# Altium schematic sheet Optocoupler Bank.SchDoc
size A
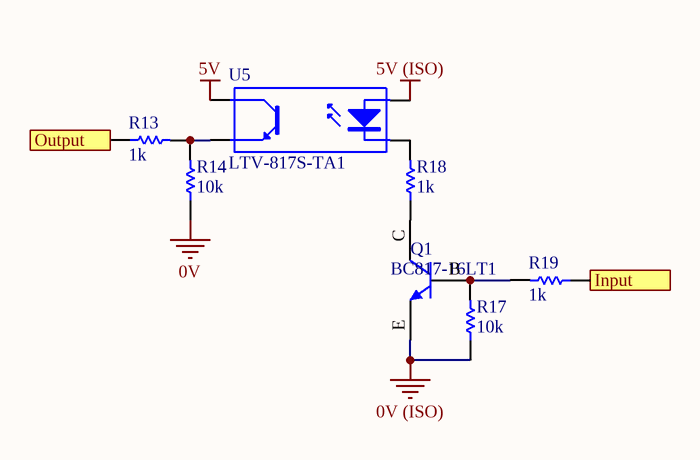
[diagram p0: Optocoupler Bank.SchDoc]

## Parts
Q1  BC817-16LT1  [ON SOT-23 BJT]
R13  1k  [0805]
R14  10k  [0805]
R17  10k  [0805]
R18  1k  [0805]
R19  1k  [0805]
U5  LTV-817S-TA1  [ON 4-SMD]

## Ports
Input (in), Output (out)

## Nets
0V: R14.1
0V (ISO): Q1.E R17.1
5V: U5.4(C)
5V (ISO): U5.1(A)
Input: R19.1 ; port Input
Output: R13.1 ; port Output
NetQ1_B: Q1.B R17.2 R19.2
NetQ1_C: Q1.C R18.1
NetR13_2: R13.2 R14.2 U5.3(E)
NetR18_2: R18.2 U5.2(K)

## Library data of the parts
Q1 = BC817-16LT1: 300mW  BJT NPN Transistor; Manufacturer: ON Semiconductor; Part Number: BC817-16LT1; Digikey Part Number: BC817-16LT1OSTR-ND; Digikey Link: https://www.digikey.com.au/product-detail/en/on-semiconductor/BC817-16LT1/BC817-16LT1OSTR-ND/606178
R13 R18 R19 = RC0805FR071KL: Manufacturer: YAGEO; Tolerance: 0.01; Rated Voltage: 0.125W; Part Number: RC0805FR071KL; Value: 1k; Material: FR-07; qty: 50
R14 R17 = RC0805FR0710KL: Manufacturer: YAGEO; Tolerance: 0.01; Rated Voltage: 0.125W; Part Number: RC0805FR0710KL; Value: 10k; Material: FR-07; qty: 50
U5 = LTV-817S-TA1: 35V 50ma Optocoupler (VF=1.2V); Manufacturer: Lite-On Inc; Part Number: LTV-817S-TA1; Digikey Part Number: 160-1893-2-ND; Digikey Link: https://www.digikey.com/product-detail/en/lite-on-inc/LTV-817S-TA1/160-1893-2-ND/388451